# Altium schematic sheet DetectorLogic2.SchDoc
size A3
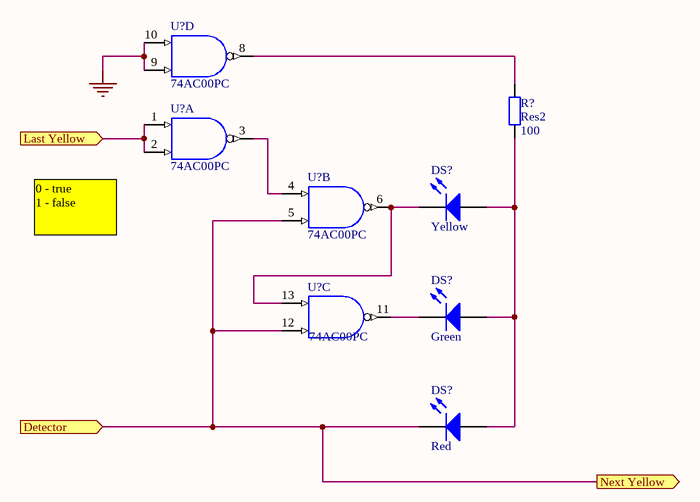
[diagram p0: DetectorLogic2.SchDoc]

## Parts
(Parts that share a designator on the sheet are numbered #1, #2 ... from top to bottom, then left to right.)
DS?#1  Yellow  [LED-0]
DS?#2  Green  [LED-0]
DS?#3  Red  [LED-0]
R?  Res2  value 100  [AXIAL-0.4]
U?#1  74AC00PC  [N14A]  (part D of 4)
U?#2  74AC00PC  [N14A]  (part A of 4)
U?#3  74AC00PC  [N14A]  (part B of 4)
U?#4  74AC00PC  [N14A]  (part C of 4)

## Ports
Detector (in), Last Yellow (in), Next Yellow (out)

## Nets
GND: U?#1.7(GND) U?#1.9(B) U?#1.10(A) U?#2.7(GND) U?#3.7(GND) U?#4.7(GND)
VCC: U?#1.14(VCC) U?#2.14(VCC) U?#3.14(VCC) U?#4.14(VCC)
Detector: DS?#3.2(K) U?#3.5(B) U?#4.12(B) ; port Detector, port Next Yellow
Last Yellow: U?#2.1(A) U?#2.2(B) ; port Last Yellow
NetDS?#1_1: DS?#1.1(A) DS?#2.1(A) DS?#3.1(A) R?.1
NetDS?#1_2: DS?#1.2(K) U?#3.6(~{O}) U?#4.13(A)
NetDS?#2_2: DS?#2.2(K) U?#4.11(~{O})
NetR?_2: R?.2 U?#1.8(~{O})
NetU?#2_3: U?#2.3(~{O}) U?#3.4(A)

## Notes on the sheet
- 0 - true
  1 - false

## Library data of the parts
DS?#1-DS?#3 = LED0: Typical INFRARED GaAs LED; Published: 8-Jun-2000; Revision: July-2002: Re-released for DXP Platform.; Publisher: Altium Limited
R? = Res2: Resistor; Published: 8-Jun-2000; Revision: July-2002: Re-released for DXP Platform.; Publisher: Altium Limited
U?#1-U?#4 = 74AC00PC: Quad 2-Input NAND Gate; Package Information: Latest Revision: 2000; Published: 17-Jul-2002; Datasheet: Latest Revision: Nov-1999; Package Reference: N14A; Publisher: Altium Limited